# Altium schematic sheet Power Sleep Timer.SchDoc: Sleep Timer
size 292 x 193 mm; SheetNumber: 6; SheetTotal: 40
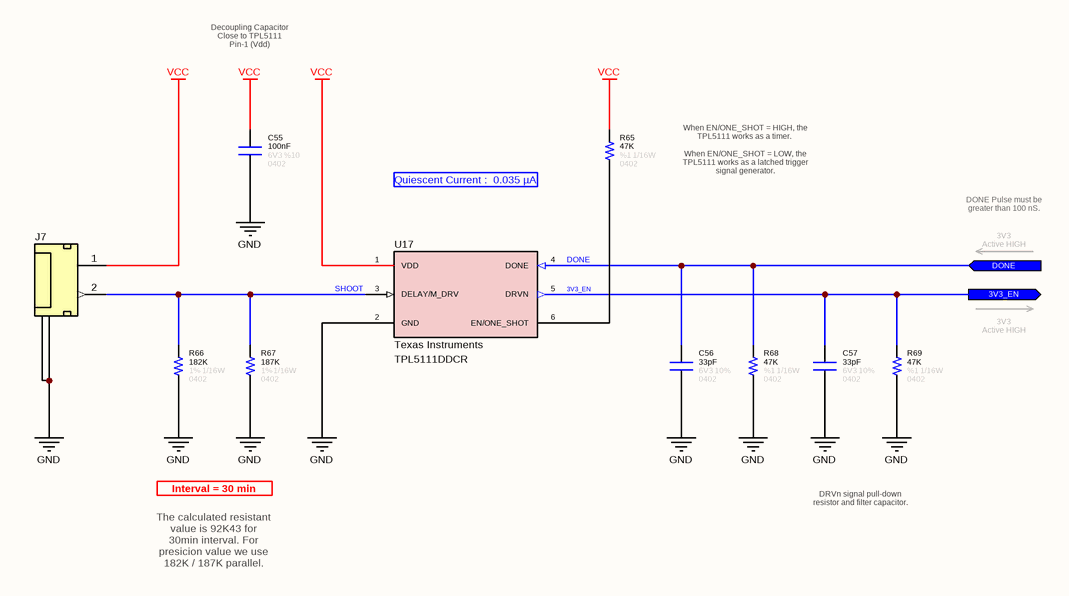
[diagram p0: Power Sleep Timer.SchDoc]

## Parts
C55  value 100nF  Tolerance: %10  Voltage: 6V3  Case: 0402  [CAPACITOR_0402]  (hidden comment: Capacitor - 100nF [0402] (Ceramic))
C56  value 33pF  Tolerance: 10%  Case: 0402  Voltage: 6V3  [CAPACITOR_0402]  (hidden comment: Capacitor - 33pF [0402] (Ceramic))
C57  value 33pF  Tolerance: 10%  Case: 0402  Voltage: 6V3  [CAPACITOR_0402]  (hidden comment: Capacitor - 33pF [0402] (Ceramic))
J7  2P SMD Tunic Connector  [Connector_Tunic 2P]  (value not drawn)
R65  value 47K  Tolerance: %1  Case: 0402  Power: 1/16W  [RESISTOR_0402]  (hidden comment: 47K - 0402 - %1 - 1/16W)
R66  value 182K  Power: 1/16W  Case: 0402  Tolerance: 1%  [RESISTOR_0402]  (hidden comment: 182K - 0402 - %1 - 1/16W)
R67  value 187K  Power: 1/16W  Case: 0402  Tolerance: 1%  [RESISTOR_0402]  (hidden comment: 187K - 0402 - %1 - 1/16W)
R68  value 47K  Tolerance: %1  Case: 0402  Power: 1/16W  [RESISTOR_0402]  (hidden comment: 47K - 0402 - %1 - 1/16W)
R69  value 47K  Tolerance: %1  Case: 0402  Power: 1/16W  [RESISTOR_0402]  (hidden comment: 47K - 0402 - %1 - 1/16W)
U17  Manufacturer Name: Texas Instruments  [SOT-23-6]  (hidden comment: TPL5111DDCR)

## Ports
3V3_EN (out), DONE (in)

## Nets
GND: C55.1 C56.1 C57.1 J7.3(GND) J7.4(GND) R66.1 R67.1 R68.1 R69.1 U17.2(GND)
VCC: C55.2 J7.1(Pin1) R65.2 U17.1(VDD)
3V3_EN: C57.2 R69.2 U17.5(DRVN) ; port 3V3_EN
DONE: C56.2 R68.2 U17.4(DONE) ; port DONE
SHOOT: J7.2(Pin2) R66.2 R67.2 U17.3(DELAY/M_DRV)
NetR65_1: R65.1 U17.6(EN/ONE_SHOT)

## Notes on the sheet
- Decoupling Capacitor
  Close to TPL5111
  Pin-1 (Vdd)
- Quiescent Current :  0.035 µA
- When EN/ONE_SHOT = HIGH, the TPL5111 works as a timer.
  When EN/ONE_SHOT = LOW, the TPL5111 works as a latched trigger signal generator.
- DONE Pulse must be greater than 100 nS.
- 3V3
  Active HIGH
- Interval = 30 min
- DRVn signal pull-down resistor and filter capacitor.
- The calculated resistant value is 92K43 for 30min interval. For presicion value we use 182K / 187K parallel.
- © 2021 All rights reserved.
  This document may not, in whole or in part, be copied, photocopied, reproduced, translated or converted to any electronic or machine readable from without prior written permission of Mehmet Günce Akkoyun.
  Engineer contact : akkoyun@me.com
- Property of
- Engineer :
- Date :
- Size :
- A4
- Time :
- Project :
- Page :
- /
- Customer :
- Product ID :
- Module ID :
- Version :
- File :
- Revision :

## Library data of the parts
C55 = Capacitor - 100nF [0402-6V3]: Capacitor - 100nF [0402-6V3] (Ceramic); Manufacturer Name: AVX; Manufacturer Part Number: 04026D104KAT4A; ComponentLink1Description: Mouser; ComponentLink1URL: https://www.mouser.com.tr/ProductDetail/AVX/04026D104KAT4A?qs=sGAEpiMZZMs0AnBnWHyRQPg4iYkCw7IMED%2F4kpqgf7w%3D; ComponentLink2Description: DataSheet; ComponentLink2URL: https://www.mouser.com.tr/datasheet/2/40/cx5r-776519.pdf
C56 C57 = Capacitor - 33pF [0402-6V3]: Manufacturer Name: Kemet; Manufacturer Part Number: C0402C330J9RACAUTO; ComponentLink1Description: DataSheet; ComponentLink1URL: https://api.kemet.com/component-edge/download/datasheet/C0402C330J9RACAUTO.pdf; ComponentLink2Description: Mouser; ComponentLink2URL: https://www.mouser.com/Search/Refine.aspx?Keyword=80-C0402C330J9RAUTO
J7 = Connector - Mini Tunic 2P (1.25): Mini Tunic Connector with 2P; Manufacturer Name: Molex; Manufacturer Part Number: 53261-0271; Height: 3.55mm; Mouser Part Number: 538-53261-0271; ROHS: Yes; System: Connector
R65 R68 R69 = Resistor - 47K [0402]: Thick Film Resistors - SMD 1/16 W 47 KOhm 1%; Manufacturer Name: Vishay; Manufacturer Part Number: CRCW040247K0FKED; ComponentLink1Description: DataSheet; ComponentLink1URL: https://www.mouser.com.tr/datasheet/2/427/dcrcwe3-1762152.pdf; ComponentLink2Description: Mouser; ComponentLink2URL: https://www.mouser.com.tr/ProductDetail/Vishay-Dale/CRCW040247K0FKED?qs=sGAEpiMZZMu61qfTUdNhG2DpbjADlD3GL%252B3h1elTxqU%3D
R66 = Resistor - 182K [0402]: Thick Film Resistors - SMD 1/16 W 182 KOhm 1%; Manufacturer Name: Vishay; Manufacturer Part Number: CRCW0402182KFKEDC
R67 = Resistor - 187K [0402]: Thick Film Resistors - SMD 1/16 W 187 KOhm 1%; Manufacturer Name: Vishay; Manufacturer Part Number: CRCW0402182KFKEDC
U17 = IC - TPL5111: NANO-POWER SYSTEM TIMER FOR POWE; Maximum Operating Temperature: + 105 C; Minimum Operating Temperature: - 40 C; RoHS: Yes; Case: SOT-23-6; Product Type: Timers; Manufacturer Part Number: TPL5111DDCR